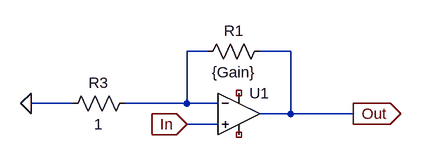
[diagram p0: schematic noninvertingOpAmp.asc]
noninvertingOpAmp.asc, the LTspice schematic file:
Version 4.1
SHEET 1 880 680
WIRE 160 80 128 80
WIRE 288 80 240 80
WIRE -48 160 -112 160
WIRE 128 160 128 80
WIRE 128 160 32 160
WIRE 176 160 128 160
WIRE 288 176 288 80
WIRE 288 176 240 176
WIRE 384 176 288 176
WIRE 176 192 128 192
FLAG -112 160 0
FLAG 128 192 In
IOPIN 128 192 In
FLAG 384 176 Out
IOPIN 384 176 Out
SYMBOL res 256 64 R90
WINDOW 0 0 56 VBottom 2
WINDOW 3 32 56 VTop 2
SYMATTR InstName R1
SYMATTR Value {Gain}
SYMBOL res 48 144 R90
WINDOW 0 0 56 VBottom 2
WINDOW 3 32 56 VTop 2
SYMATTR InstName R3
SYMATTR Value 1
SYMBOL OpAmps\\UniversalOpAmp 208 176 R0
SYMATTR InstName U1

The netlist it stands for:
* noninvertingOpAmp.asc
R1 Out N001 {Gain}
R3 N001 0 1
X§U1 In N001 NC_01 NC_02 Out level1 Avol=1Meg GBW=10Meg Vos=0 En=0 Enk=0 In=0 Ink=0 Rin=500Meg  ; pins In+ In- V+ V- OUT
.lib UniversalOpAmp1.lib
.backanno
.end